# EAGLE design nodoSensorXbee_v3_2 (EAGLE 9.5.2)
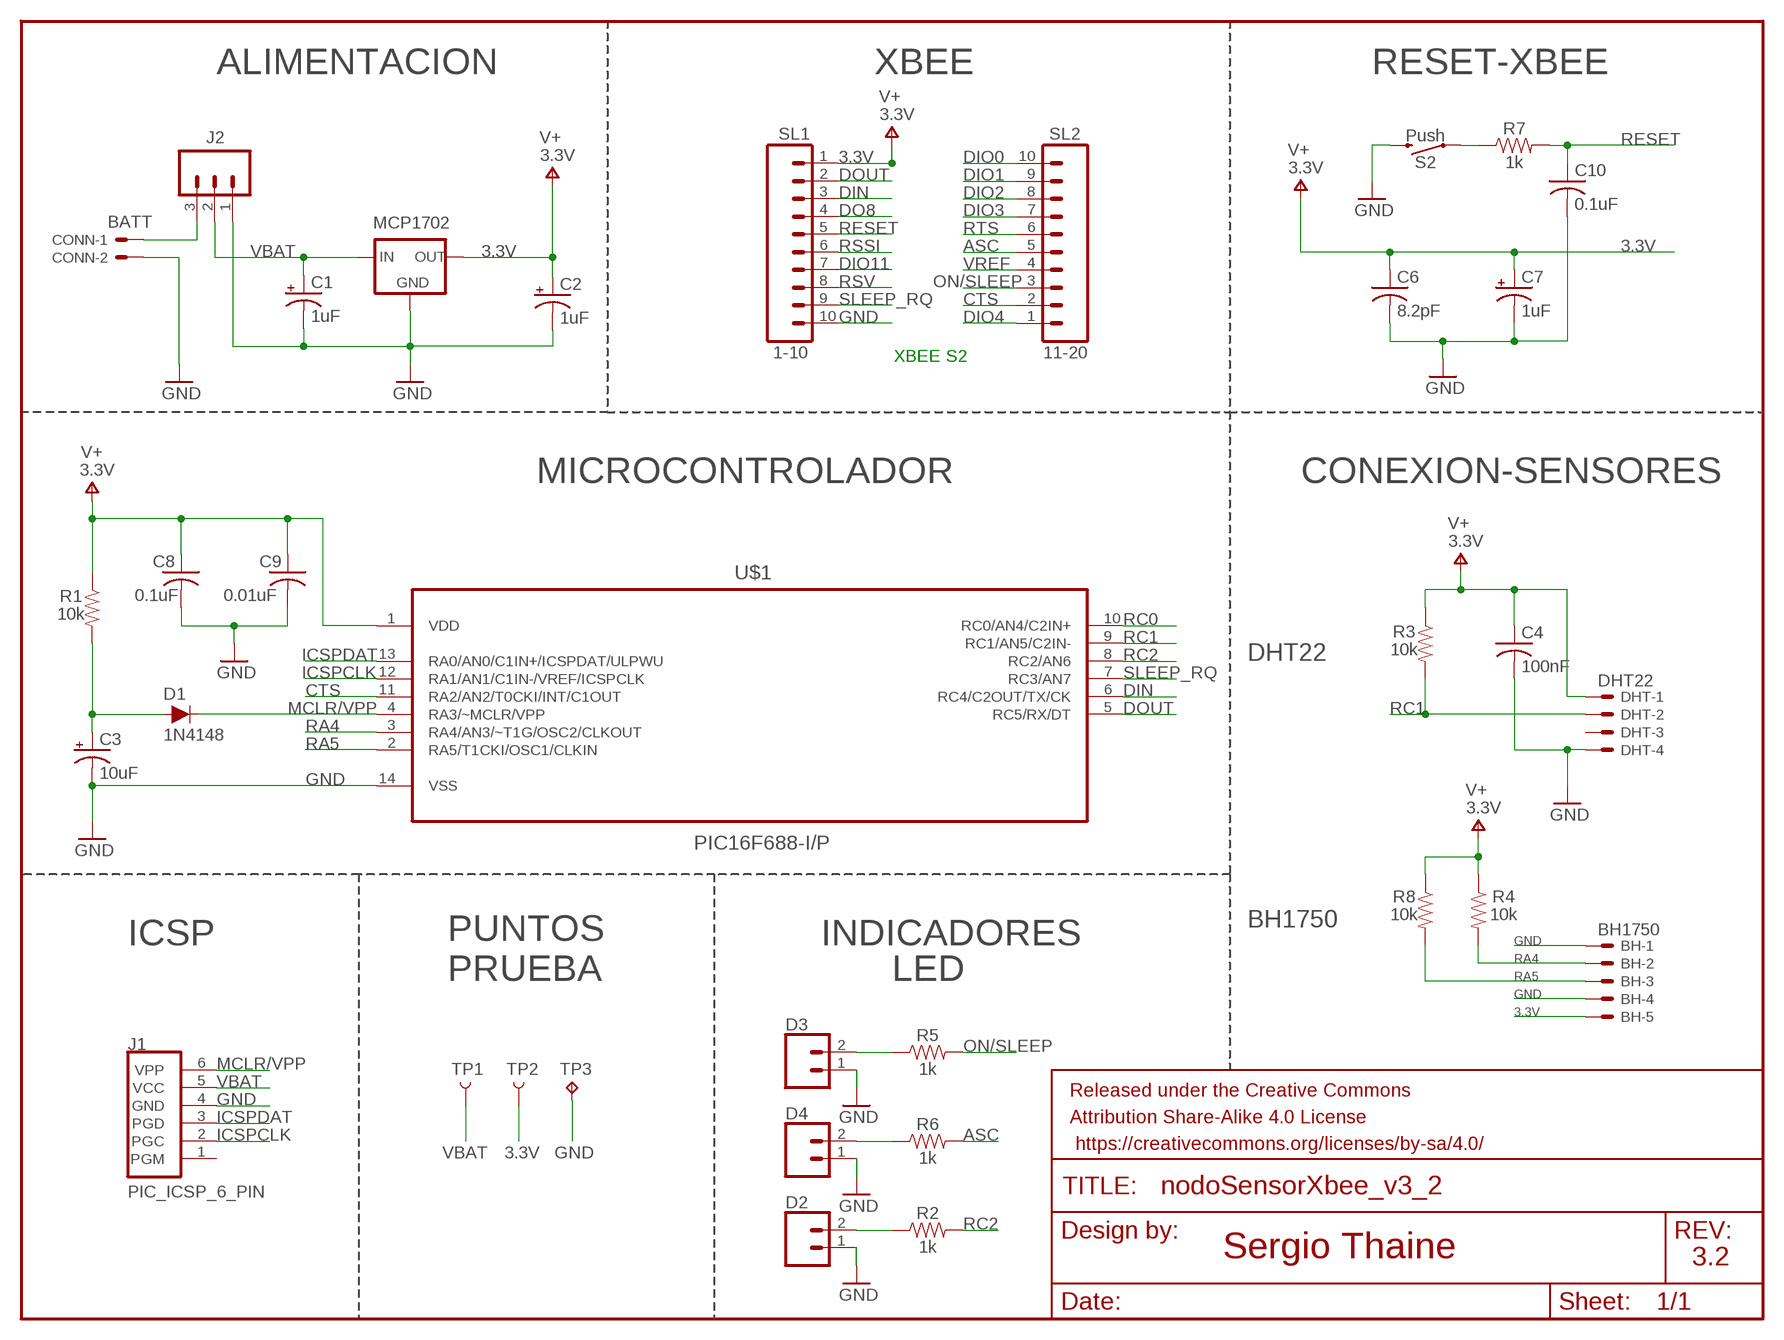
[diagram p0: schematic, sheet 1]

## Parts
BH  BH1750  22-27-2051-05  [6410-05]
C1  1uF  CPOL-USE2-5  [E2-5]
C2  1uF  CPOL-USE2-5  [E2-5]
C3  10uF  CPOL-USE2-5  [E2-5]
C4  100nF  C-US025-030X050  [C025-030X050]
C6  8.2pF  C-US025-030X050  [C025-030X050]
C7  1uF  CPOL-USE2-5  [E2-5]
C8  0.1uF  C-US025-030X050  [C025-030X050]
C9  0.01uF  C-US025-030X050  [C025-030X050]
C10  0.1uF  C-US025-030X050  [C025-030X050]
CONN  BATT  22-27-2021-02  [6410-02]
D1  1N4148  DIODE-1N4148  [DIODE-1N4148]
D2  CONN_02POLAR  [MOLEX-1X2]
D3  CONN_02POLAR  [MOLEX-1X2]
D4  CONN_02POLAR  [MOLEX-1X2]
DHT  DHT22  22-27-2041-04  [6410-04]
FRAME1  FRAME-LETTERNO_PACKAGE  [DUMMY]
J1  PIC_ICSP_6_PIN  [MOLEX-1X6]
J2  CONN_03POLAR  [MOLEX-1X3]
MCP1702  3.3v  MCP1700TRI  [TO92]
R1  10k  10KOHM-HORIZ_KIT-1/4W-1%  [AXIAL-0.3-KIT]
R2  1k  10KOHM-HORIZ_KIT-1/4W-1%  [AXIAL-0.3-KIT]
R3  10k  10KOHM-HORIZ_KIT-1/4W-1%  [AXIAL-0.3-KIT]
R4  10k  10KOHM-HORIZ_KIT-1/4W-1%  [AXIAL-0.3-KIT]
R5  1k  10KOHM-HORIZ_KIT-1/4W-1%  [AXIAL-0.3-KIT]
R6  1k  10KOHM-HORIZ_KIT-1/4W-1%  [AXIAL-0.3-KIT]
R7  1k  10KOHM-HORIZ_KIT-1/4W-1%  [AXIAL-0.3-KIT]
R8  10k  10KOHM-HORIZ_KIT-1/4W-1%  [AXIAL-0.3-KIT]
S2  Push  MOMENTARY-SWITCH-SPST-PTH-6.0MM  [TACTILE_SWITCH_PTH_6.0MM]
SL1  1-10  M10  [10P]
SL2  11-20  M10  [10P]
TP1  VBAT  TEST-POINT3X5  [PAD.03X.05]
TP2  3.3V  TEST-POINT3X5  [PAD.03X.05]
TP3  TPPAD1-13  [P1-13]
U$1  PIC16F688-I/P  [DIP254P762X533-14]

## Nets
3.3V [supply]: BH.5 C2.+ C4.1 C6.1 C7.+ C8.1 C9.1 DHT.1 MCP1702.3(OUT) R1.P$1 R3.P$1 R4.P$1 R8.P$1 SL1.1 TP2.P$1 U$1.1(VDD) ; supply symbol labelled V+
ASC: R6.P$2 SL2.5
CTS: SL2.2 U$1.11(RA2/AN2/T0CKI/INT/C1OUT)
DIN: SL1.3 U$1.6(RC4/C2OUT/TX/CK)
DIO0: SL2.10
DIO1: SL2.9
DIO2: SL2.8
DIO3: SL2.7
DIO4: SL2.1
DIO11: SL1.7
DO8: SL1.4
DOUT: SL1.2 U$1.5(RC5/RX/DT)
GND [supply]: BH.1 BH.4 C1.- C2.- C3.- C4.2 C6.2 C7.- C8.2 C9.2 C10.2 CONN.2 D2.1 D3.1 D4.1 DHT.4 J1.4(GND) J2.1 MCP1702.1(GND) S2.3 SL1.10 TP3.TP U$1.14(VSS)
ICSPCLK: J1.2(PGC) U$1.12(RA1/AN1/C1IN-/VREF/ICSPCLK)
ICSPDAT: J1.3(PGD) U$1.13(RA0/AN0/C1IN+/ICSPDAT/ULPWU)
MCLR/VPP: D1.C J1.6(VPP) U$1.4(RA3/~MCLR/VPP)
N$3 [supply]: CONN.1 J2.3
N$4: C3.+ D1.A R1.P$2
N$5: D3.2 R5.P$1
N$6: D4.2 R6.P$1
N$7: D2.2 R2.P$1
N$15: R7.P$1 S2.1
ON/SLEEP: R5.P$2 SL2.3
RA4: BH.2 R4.P$2 U$1.3(RA4/AN3/~T1G/OSC2/CLKOUT)
RA5: BH.3 R8.P$2 U$1.2(RA5/T1CKI/OSC1/CLKIN)
RC0: U$1.10(RC0/AN4/C2IN+)
RC1: DHT.2 R3.P$2 U$1.9(RC1/AN5/C2IN-)
RC2: R2.P$2 U$1.8(RC2/AN6)
RESET: C10.1 R7.P$2 SL1.5
RSSI: SL1.6
RSV: SL1.8
RTS: SL2.6
SLEEP_RQ: SL1.9 U$1.7(RC3/AN7)
VBAT [supply]: C1.+ J1.5(VCC) J2.2 MCP1702.2(IN) TP1.P$1
VREF: SL2.4
Unconnected: DHT.3 J1.1(PGM)

## Notes on the sheet
- ALIMENTACION | XBEE | RESET-XBEE
- 3.3V
- 3.3V
- XBEE S2
- MICROCONTROLADOR | CONEXION-SENSORES
- DHT22
- BH1750
- ICSP | INDICADORES
- PUNTOS
  PRUEBA
- LED
- Sergio Thaine | 3.2

## Library data of the parts
BH = con-molex:22-?-05: CONNECTOR wire to board 2.54 mm (.1 inch) pitch header; OC_FARNELL: unknown; OC_NEWARK: unknown
C1-C3 C7 = adafruit:CPOL-US: POLARIZED CAPACITOR, American symbol
C4 C6 C8-C10 = adafruit:C-US: CAPACITOR, American symbol
CONN = con-molex:22-?-02: CONNECTOR wire to board 2.54 mm (.1 inch) pitch header; OC_FARNELL: unknown; OC_NEWARK: unknown
D1 = SparkFun-DiscreteSemi:DIODE: Diode These are standard reverse protection diodes and small signal diodes. SparkFun Products: SparkFun SparkPunk Sound Kit <https://www.sparkfun.com/products/11177> SparkFun ESP8266 Thing <https://www.sparkfun.com/products/13231>; PROD_ID: DIO-08378; VALUE: 200mA/100V/1V
D2-D4 = SparkFun-Connectors:CONN_02: Multi connection point. Often used as Generic Header-pin footprint for 0.1 inch spaced/style header connections On any of the 0.1 inch spaced packages, you can populate with these: Break Away Headers - Straight <https://www.sparkfun.com/products/116> (PRT-00116) Break Away Male Headers - Right Angle <https://www.sparkfun.com/products/553> (PRT-00553) Female Headers <https://www.sparkfun.com/products/115> (PRT-00115) Break Away Headers - Machine Pin <https://www.sparkfun.com/products/117> (PRT-00117) Break Away Female Headers - Swiss Machine Pin <https://www.sparkfun.com/products/743> (PRT-00743) For SCREWTERMINALS and SPRING TERMINALS visit here: Screw Terimnals on SparkFun.com <https://www.sparkfun.com/search/results?term=Screw+Terminals> (5mm/3.5mm/2.54mm spacing) This device is also useful as a general connection point to wire up your design to another part of your project. Our various solder wires solder well into these plated through hole pads. Hook-Up Wire - Assortment (Stranded, 22 AWG) <https://www.sparkfun.com/products/11375> (PRT-11375) Hook-Up Wire - Assortment (Solid Core, 22 AWG) <https://www.sparkfun.com/products/11367> (PRT-11367) View the entire wire category on our website here <https://www.sparkfun.com/categories/141> Special notes: Molex polarized connector foot print use with: PRT-08233 with associated crimp pins and housings. 2.54_SCREWTERM for use with PRT-10571. 3.5mm Screw Terminal footprints for PRT-08084 5mm Screw Terminal footprints for use with PRT-08432; SF_ID: PRT-09918
DHT = con-molex:22-?-04: CONNECTOR wire to board 2.54 mm (.1 inch) pitch header; OC_FARNELL: unknown; OC_NEWARK: unknown
FRAME1 = SparkFun-Aesthetics:FRAME-LETTER: Schematic Frame - Letter Standard 8.5x11 US Letter frame; DESIGNER: Nobody; VERSION: v01
J1 = SparkFun-Connectors:PIC_ICSP_6_PIN: ISCP Programming connector for PICs This 6 pin header contains all the lines necessary for programming most PIC microcontrollers. Here is the connector we sell at SparkFun: Polarized Connectors - Header (6-Pin) <https://www.sparkfun.com/products/8094> (PRT-08094) It is used on this SparkFun product: SparkFun UDB5 - PIC UAV Development Board <https://www.sparkfun.com/products/11703> (DEV-11703) Also, if you need a nice PIC programmer, please check these out: MPLAB PICkit 3 <https://www.sparkfun.com/products/9973> (PGM-09973); PROD_ID: CONN-08046; SF_ID: PRT-08094
J2 = SparkFun-Connectors:CONN_03: Multi connection point. Often used as Generic Header-pin footprint for 0.1 inch spaced/style header connections On any of the 0.1 inch spaced packages, you can populate with these: Break Away Headers - Straight <https://www.sparkfun.com/products/116> (PRT-00116) Break Away Male Headers - Right Angle <https://www.sparkfun.com/products/553> (PRT-00553) Female Headers <https://www.sparkfun.com/products/115> (PRT-00115) Break Away Headers - Machine Pin <https://www.sparkfun.com/products/117> (PRT-00117) Break Away Female Headers - Swiss Machine Pin <https://www.sparkfun.com/products/743> (PRT-00743) Stackable Header - 3 Pin (Female, 0.1") <https://www.sparkfun.com/products/13875> (PRT-13875) For SCREWTERMINALS and SPRING TERMINALS visit here: Screw Terimnals on SparkFun.com <https://www.sparkfun.com/search/results?term=Screw+Terminals> (5mm/3.5mm/2.54mm spacing) This device is also useful as a general connection point to wire up your design to another part of your project. Our various solder wires solder well into these plated through hole pads. Hook-Up Wire - Assortment (Stranded, 22 AWG) <https://www.sparkfun.com/products/11375> (PRT-11375) Hook-Up Wire - Assortment (Solid Core, 22 AWG) <https://www.sparkfun.com/products/11367> (PRT-11367) View the entire wire category on our website here <https://www.sparkfun.com/categories/141> Special notes: Molex polarized connector foot print use with SKU : PRT-08232 with associated crimp pins and housings.; PROD_ID: CONN-08625; SF_ID: PRT-08096
MCP1702 = adafruit:MCP1700: VOLTAGE REGULATOR
R1 R3 R4 R8 = SparkFun-Resistors:10KOHM: 10kΩ resistor A resistor is a passive two-terminal electrical component that implements electrical resistance as a circuit element. Resistors act to reduce current flow, and, at the same time, act to lower voltage levels within circuits. - Wikipedia; PROD_ID: RES-12183
R2 R5-R7 = SparkFun-Resistors:10KOHM: 10kΩ resistor A resistor is a passive two-terminal electrical component that implements electrical resistance as a circuit element. Resistors act to reduce current flow, and, at the same time, act to lower voltage levels within circuits. - Wikipedia; PROD_ID: RES-12183; VALUE: 10k
S2 = SparkFun-Switches:MOMENTARY-SWITCH-SPST: Momentary Switch (Pushbutton) - SPST Normally-open (NO) SPST momentary switches (buttons, pushbuttons). Variants PTH-12MM - 12mm square, through-hole Momentary Pushbutton Switch - 12mm Square <https://www.sparkfun.com/products/9190> (COM-09190) PTH-6.0MM, PTH-6.0MM-KIT - 6.0mm square, through-hole Mini Pushbutton Switch <https://www.sparkfun.com/products/97> (COM-00097) KIT package intended for soldering kit's - only one side of pads' copper is exposed. PTH-RIGHT-ANGLE-KIT - Right-angle, through-hole Right Angle Tactile Button <https://www.sparkfun.com/products/10791> - Used on SparkFun BigTime Watch Kit <https://www.sparkfun.com/products/11734> SMD-12MM - 12mm square, surface-mount Tactile Button - SMD (12mm) <https://www.sparkfun.com/products/12993> (COM-12993) Used on SparkFun PicoBoard <https://www.sparkfun.com/products/11888> SMD-4.5MM - 4.5mm Square Trackball Switch Used on SparkFun Blackberry Trackballer Breakout <https://www.sparkfun.com/products/13169> SMD-4.6MMX2.8MM - 4.60mm x 2.80mm, surface mount Used on SparkFun SAMD21 Mini Breakout <https://www.sparkfun.com/products/13664> SMD-5.2MM, SMD-5.2-REDUNDANT - 5.2mm square, surface-mount Mini Pushbutton Switch - SMD <https://www.sparkfun.com/products/8720> (COM-08720) Used on Arduino Pro Mini <https://www.sparkfun.com/products/11114> REDUNDANT package connects both switch circuits together SMD-6.0X3.5MM - 6.0 x 3.5mm, surface mount Momentary Reset Switch SMD <https://www.sparkfun.com/products/8229> (COM-08229) SMD-6.2MM-TALL - 6.2mm square, surface mount Tactile Button - SMD (6mm) <https://www.sparkfun.com/products/12992> Used on SparkFun Digital Sandbox <https://www.sparkfun.com/products/12651> SMD-RIGHT-ANGLE - Right-angle, surface mount Used on SparkFun Block for Intel® Edison - Arduino <https://www.sparkfun.com/products/13036>; PROD_ID: SWCH-08441; SF_SKU: COM-00097
SL1 SL2 = con-amp-quick:M10: AMP QUICK CONNECTOR; OC_FARNELL: unknown; OC_NEWARK: unknown
TP1 TP2 = SparkFun-Connectors:TEST-POINT: SparkFun Test Points Bare copper test points for troubleshooting or In-Circuit-Testing. These are used by our Production team for verifying production board runs using pogo-pins on test beds. SparkFun Products: SparkFun LSM9DS1 Breakout <https://www.sparkfun.com/products/13284> SparkFun PSOC <https://www.sparkfun.com/products/13714> SparkFun Load Cell Amplifier <https://www.sparkfun.com/products/13879>
TP3 = testpad:TP: Test pad
U$1 = Microchip_By_element14_Batch_1:PIC16F688-I/P: CMOS Microcontrollers; MPN: PIC16F688-I/P; OC_FARNELL: 9760563; OC_NEWARK: 60K6714; PACKAGE: DIP-14; SUPPLIER: Microchip

## Net classes
0 default: width 0.254 mm, clearance 0.254 mm
1 supply: width 0.61 mm, clearance 0.508 mm

## Board
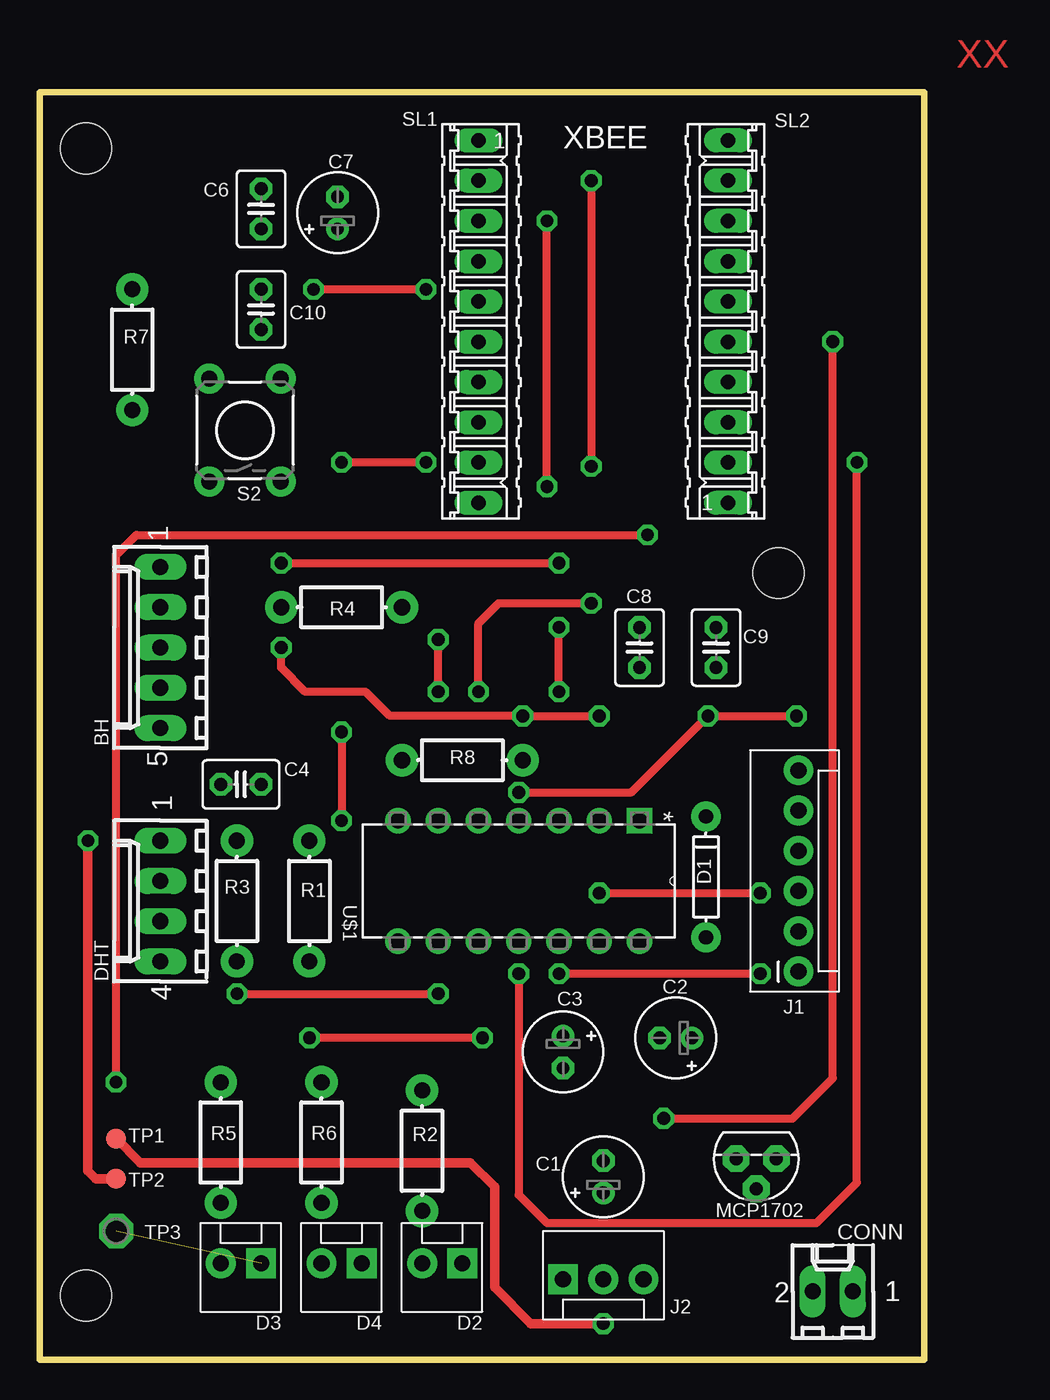
[diagram p1: board, top side]
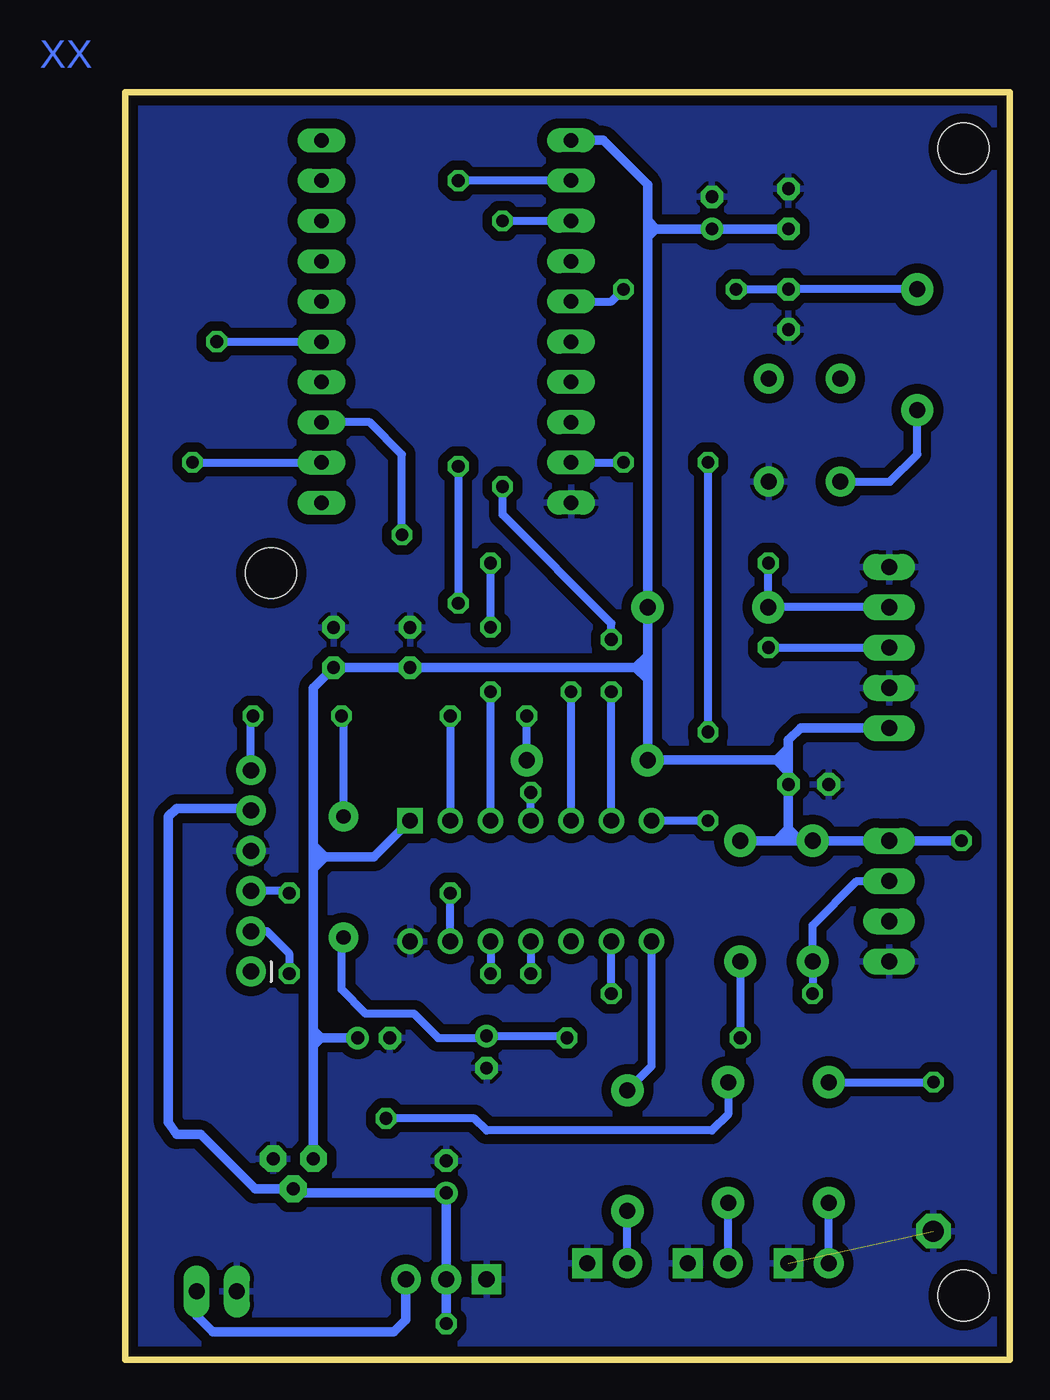
[diagram p2: board, bottom side, seen from below]

Size 55.8 x 80 mm. Coordinates in mm from the lower left corner, seen from the top.
Outline: 0,0 55.8,0 55.8,80 0,80 0,0
Copper layers (1*16): Top 0.035mm / dielectric 1.5mm / Bottom 0.035mm
Design rules "SparkFun *": minimum track width 20mil, minimum drill 20mil, track to track 8mil, track to pad 8mil, pad to pad 8mil, via to via 8mil, smd to smd 8mil, copper to edge 10mil, drill to drill 8mil, minimum pad ring 12mil, minimum via ring 10mil, stop-mask expansion 4mil, vias tented up to drill 25mil, thermal gap 10mil
Holes 3.2 mm at 2.92,76.45 2.92,4.06 46.61,49.66

### Footprints (pad centres in the part's own frame; a part is rotated, then mirrored left to right if it is on the bottom)
6410-05 = drill 1.016 long: 1 5.08,0; 2 2.54,0; 3 0,0; 4 -2.54,0; 5 -5.08,0
E2-5 = drill 0.813 pad 1.422: + -1.016,0 | drill 0.813 pad 1.422 octagon: - 1.016,0
C025-030X050 = drill 0.813 pad 1.422 octagon: 1 -1.27,0; 2 1.27,0
6410-02 = drill 1.016 long: 1 1.27,0; 2 -1.27,0
DIODE-1N4148 = drill 0.9 pad 1.88: A -3.81,0; C 3.81,0
MOLEX-1X2 = drill 1.016 pad 1.88 square: 1 0,0 | drill 1.016 pad 1.88: 2 2.54,0
6410-04 = drill 1.016 long: 1 3.81,0; 2 1.27,0; 3 -1.27,0; 4 -3.81,0
MOLEX-1X6 = drill 1.016 pad 1.88: 1 0,0; 2 2.54,0; 3 5.08,0; 4 7.62,0; 5 10.16,0; 6 12.7,0
MOLEX-1X3 = drill 1.016 pad 1.88 square: 1 0,0 | drill 1.016 pad 1.88: 2 2.54,0; 3 5.08,0
TO92 = drill 0.813 pad 1.676 octagon: 1 -1.27,0; 2 0,1.905; 3 1.27,0
AXIAL-0.3-KIT = drill 1.016 pad 2.032: P$1 -3.81,0; P$2 3.81,0
TACTILE_SWITCH_PTH_6.0MM = drill 1.016 pad 1.88: 1 -3.251,2.261; 2 3.251,2.261; 3 -3.251,-2.261; 4 3.251,-2.261
10P = drill 0.914 long: 1 -11.43,0; 2 -8.89,0; 3 -6.35,0; 4 -3.81,0; 5 -1.27,0; 6 1.27,0; 7 3.81,0; 8 6.35,0; 9 8.89,0; 10 11.43,0
PAD.03X.05 = smd 1.27 x 1.27: P$1 0,0
P1-13 = drill 1.321 pad 2.159 octagon: TP 0,0
DIP254P762X533-14 = drill 0.991 square: 1 -7.62,15.24 | drill 0.991: 2 -7.62,12.7; 3 -7.62,10.16; 4 -7.62,7.62; 5 -7.62,5.08; 6 -7.62,2.54; 7 -7.62,0; 8 0,0; 9 0,2.54; 10 0,5.08; 11 0,7.62; 12 0,10.16; 13 0,12.7; 14 0,15.24

### Placement (x,y rotation side)
BH  7.62,44.96 90 top
C1  35.56,11.56 90 top
C2  40.13,20.32 180 top
C3  33.02,19.43 270 top
C4  12.7,36.32 180 top
C6  13.97,72.64 90 top
C7  18.8,72.39 90 top
C8  37.85,44.96 90 top
C9  42.67,44.96 90 top
C10  13.97,66.29 270 top
CONN  50.04,4.32 0 top
D1  42.04,30.48 90 top
D2  26.67,6.1 180 top
D3  13.97,6.1 180 top
D4  20.32,6.1 180 top
DHT  7.62,28.96 90 top
FRAME1  49.53,78.99 0 top
J1  47.88,24.51 90 top
J2  33.02,5.08 0 top
MCP1702  45.21,12.7 180 top
R1  17.02,28.96 270 top
R2  24.13,13.21 90 top
R3  12.45,28.96 270 top
R4  19.05,47.5 180 top
R5  11.43,13.72 90 top
R6  17.78,13.72 90 top
R7  5.84,63.75 90 top
R8  26.67,37.85 0 top
S2  12.95,58.67 90 top
SL1  27.69,65.53 270 top
SL2  43.43,65.53 90 top
TP1  4.83,13.97 0 top
TP2  4.83,11.43 0 top
TP3  4.83,8.13 0 top
U$1  22.61,26.42 270 top

### Tracks (layer width: path | path; a pad name or v marks a point on that pad's centre or on a via)
3.3V  (via drill 0.8)
  Top 0.61: TP2.P$1 3.56,11.43 3.05,11.94 v3.05,32.77
  Bottom 0.61: 43.94,30.99 43.94,31.75 | 43.94,31.75 43.94,32.51 | 43.18,31.75 43.94,31.75 | 43.18,31.75 43.94,32.51 | 43.18,31.75 43.94,30.99 | C6.1 C7.+ 22.35,71.37 | R1.P$1 14.73,32.77 | 14.73,32.77 13.97,32.77 | 13.97,32.77 13.21,32.77 | 13.21,32.77 R3.P$1 DHT.1 v3.05,32.77 | 43.94,32.51 43.94,42.42 C9.1 C8.1 23.62,43.69 | 22.86,42.93 R8.P$1 14.73,37.85 | 22.86,42.93 22.86,43.69 | 22.86,43.69 22.86,44.45 | 22.86,44.45 R4.P$1 22.86,70.87 | 23.62,43.69 22.86,43.69 | 23.62,43.69 22.86,44.45 | 23.62,43.69 22.86,42.93 | MCP1702.3 43.94,19.81 | 43.94,19.81 43.94,20.32 | 43.94,20.32 43.94,20.83 | 43.94,20.83 43.94,30.99 | C2.+ 43.43,20.32 | 43.43,20.32 43.94,20.32 | 43.43,20.32 43.94,20.83 | 43.43,20.32 43.94,19.81 | 13.97,33.53 C4.1 13.97,37.08 | 13.97,33.53 13.97,32.77 | 13.97,33.53 13.21,32.77 | 13.97,33.53 14.73,32.77 | 22.86,70.87 22.86,71.12 | 22.35,71.37 22.61,71.37 22.86,71.12 | 22.86,71.12 22.86,71.88 | 22.86,71.88 22.86,74.17 25.65,76.96 SL1.1 | 22.35,71.37 22.86,71.88 | 22.35,71.37 22.86,70.87 | U$1.1 40.13,31.75 43.18,31.75 | BH.5 13.21,39.88 13.97,39.12 13.97,38.61 | 13.97,38.61 13.97,37.85 | 13.97,37.85 13.97,37.08 | 14.73,37.85 13.97,37.85 | 13.97,38.61 14.73,37.85 | 13.97,37.08 14.73,37.85
ASC  (via drill 0.8)
  Top 0.508: v50.04,64.26 50.04,17.78 47.5,15.24 v39.37,15.24
  Bottom 0.508: R6.P$2 17.78,15.49 18.8,14.48 33.02,14.48 33.78,15.24 v39.37,15.24 | v50.04,64.26 SL2.5
CTS  (via drill 0.8)
  Top 0.508: v30.23,24.38 30.23,10.41 32,8.64 49.02,8.64 51.56,11.18 v51.56,56.64
  Bottom 0.508: U$1.11 v30.23,24.38 | v51.56,56.64 SL2.2
DIN  (via drill 0.8)
  Top 0.508: v25.15,42.16 v25.15,45.47 | v32,55.12 v32,71.88
  Bottom 0.508: U$1.6 v25.15,42.16 | v32,71.88 SL1.3 | v25.15,45.47 25.15,46.48 32,53.34 v32,55.12
DOUT  (via drill 0.8)
  Top 0.508: v27.69,42.16 27.69,46.48 28.96,47.75 v34.8,47.75 | v34.8,74.42 v34.8,56.39
  Bottom 0.508: U$1.5 v27.69,42.16 | SL1.2 v34.8,74.42 | v34.8,56.39 v34.8,47.75
GND  (1 unrouted)
  pour Bottom (isolate 0.61): 0.25,0.51 55.37,0.51 55.37,80.01 0.25,79.76
ICSPCLK  (via drill 0.8)
  Top 0.508: v32.77,24.38 v45.47,24.38
  Bottom 0.508: U$1.12 v32.77,24.38 | J1.2 46.86,27.05 45.47,25.65 v45.47,24.38
ICSPDAT  (via drill 0.8)
  Top 0.508: v35.31,29.46 v45.47,29.46
  Bottom 0.508: U$1.13 v35.31,29.46 | v45.47,29.46 45.59,29.59 J1.3
MCLR/VPP  (via drill 0.8)
  Top 0.508: v30.23,35.81 37.34,35.81 v42.16,40.64 v47.75,40.64
  Bottom 0.508: U$1.4 v30.23,35.81 | J1.6 47.88,40.51 v47.75,40.64 | D1.C 42.04,40.51 v42.16,40.64
N$3
  Bottom 0.61: CONN.1 51.31,2.79 50.29,1.78 38.86,1.78 38.1,2.54 J2.3
N$4  (via drill 0.8)
  Top 0.508: v27.94,20.32 v17.02,20.32
  Bottom 0.508: R1.P$2 v17.02,20.32 | D1.A 42.16,26.54 42.16,23.37 40.64,21.84 37.59,21.84 36.07,20.32 33.15,20.32 C3.+ 28.07,20.45 v27.94,20.32
N$5
  Bottom 0.508: D3.2 R5.P$1
N$6
  Bottom 0.508: D4.2 R6.P$1
N$7
  Bottom 0.508: D2.2 R2.P$1
N$15
  Bottom 0.508: S2.1 7.57,55.42 5.84,57.15 R7.P$1
ON/SLEEP  (via drill 0.8)
  Top 0.508: v38.35,52.07 6.1,52.07 4.83,50.8 v4.83,17.53
  Bottom 0.508: v38.35,52.07 38.35,57.15 40.39,59.18 SL2.3 | R5.P$2 v4.83,17.53
RA4  (via drill 0.8)
  Top 0.508: v15.24,50.29 v32.77,50.29 | v32.77,42.16 v32.77,46.23
  Bottom 0.508: U$1.3 v32.77,42.16 | v15.24,50.29 R4.P$2 BH.2 | v32.77,46.23 v32.77,50.29
RA5  (via drill 0.8)
  Top 0.508: v35.31,40.64 v30.48,40.64 22.1,40.64 20.57,42.16 16.76,42.16 15.24,43.69 v15.24,44.96
  Bottom 0.508: v35.31,40.64 U$1.2 | R8.P$2 v30.48,40.64 | v15.24,44.96 BH.3
RC1  (via drill 0.8)
  Top 0.508: v12.45,23.11 v25.15,23.11
  Bottom 0.508: v12.45,23.11 R3.P$2 12.45,27.43 9.65,30.23 DHT.2 | v25.15,23.11 U$1.9
RC2
  Bottom 0.508: R2.P$2 22.61,18.54 U$1.8
RESET  (via drill 0.8)
  Top 0.508: v17.27,67.56 v24.38,67.56
  Bottom 0.508: R7.P$2 C10.1 v17.27,67.56 | SL1.5 25.15,66.8 v24.38,67.56
SLEEP_RQ  (via drill 0.8)
  Top 0.508: v24.38,56.64 v19.05,56.64 | v19.05,39.62 v19.05,34.04
  Bottom 0.508: SL1.9 v24.38,56.64 | v19.05,56.64 v19.05,39.62 | U$1.7 v19.05,34.04
VBAT  (via drill 0.8)
  Top 0.61: v35.56,2.29 30.99,2.29 28.7,4.57 28.7,10.92 27.18,12.45 6.35,12.45 TP1.P$1
  Bottom 0.61: J1.5 48.01,34.8 52.58,34.8 53.09,34.29 53.09,14.99 52.58,14.22 51.05,14.22 47.62,10.79 MCP1702.2 44.96,10.54 C1.+ J2.2 v35.56,2.29

### Text on the board
Top: XX | XX | XX | XX
Bottom: XX | XX | XX | XX
tNames: XBEE | TP1 | TP2
Holes: SensorNode_v3.2